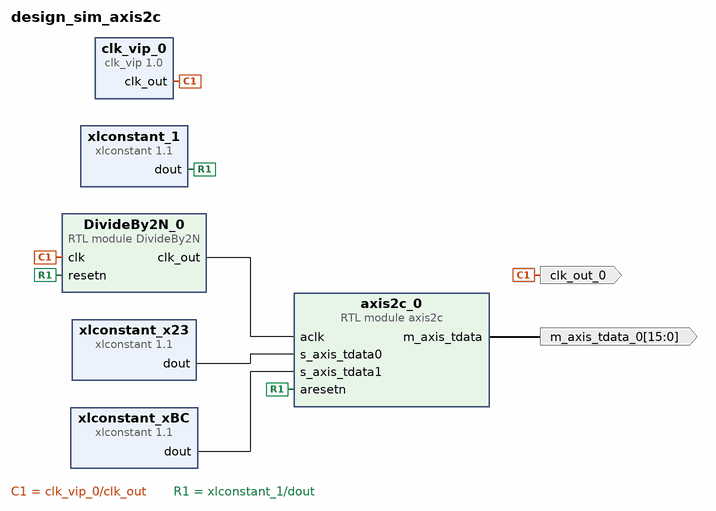
[diagram p0: block diagram of the top level]
# Vivado block design design_sim_axis2c, xc7z010clg400-1, Vivado 2022.2
create_bd_design design_sim_axis2c

create_bd_port -dir O -from 15 -to 0 m_axis_tdata_0
create_bd_port -dir O -type clk clk_out_0

create_bd_cell -type ip -vlnv xilinx.com:ip:clk_vip:1.0 clk_vip_0
set_property -dict {CONFIG.INTERFACE_MODE MASTER} [get_bd_cells clk_vip_0]
create_bd_cell -type ip -vlnv xilinx.com:ip:xlconstant:1.1 xlconstant_1
create_bd_cell -type ip -vlnv xilinx.com:ip:xlconstant:1.1 xlconstant_x23
set_property -dict {CONFIG.CONST_VAL 0x23 CONFIG.CONST_WIDTH 16} [get_bd_cells xlconstant_x23]
create_bd_cell -type ip -vlnv xilinx.com:ip:xlconstant:1.1 xlconstant_xBC
set_property -dict {CONFIG.CONST_VAL 0xbc CONFIG.CONST_WIDTH 16} [get_bd_cells xlconstant_xBC]
create_bd_cell -type module -reference DivideBy2N DivideBy2N_0
set_property -dict {CONFIG.N 2 CONFIG.WIDTH 2} [get_bd_cells DivideBy2N_0]
create_bd_cell -type module -reference axis2c axis2c_0

# ---- connections ----

connect_bd_net [get_bd_pins DivideBy2N_0/clk_out] [get_bd_pins axis2c_0/aclk]
connect_bd_net [get_bd_pins axis2c_0/m_axis_tdata] [get_bd_ports m_axis_tdata_0]
connect_bd_net [get_bd_pins clk_vip_0/clk_out] [get_bd_ports clk_out_0] [get_bd_pins DivideBy2N_0/clk]
connect_bd_net -net xlconstant_0_dout [get_bd_pins xlconstant_1/dout] [get_bd_pins DivideBy2N_0/resetn] [get_bd_pins axis2c_0/aresetn]
connect_bd_net [get_bd_pins xlconstant_x23/dout] [get_bd_pins axis2c_0/s_axis_tdata0]
connect_bd_net [get_bd_pins xlconstant_xBC/dout] [get_bd_pins axis2c_0/s_axis_tdata1]

validate_bd_design
save_bd_design
